# Altium project I2C_module_v1.PrjPcb
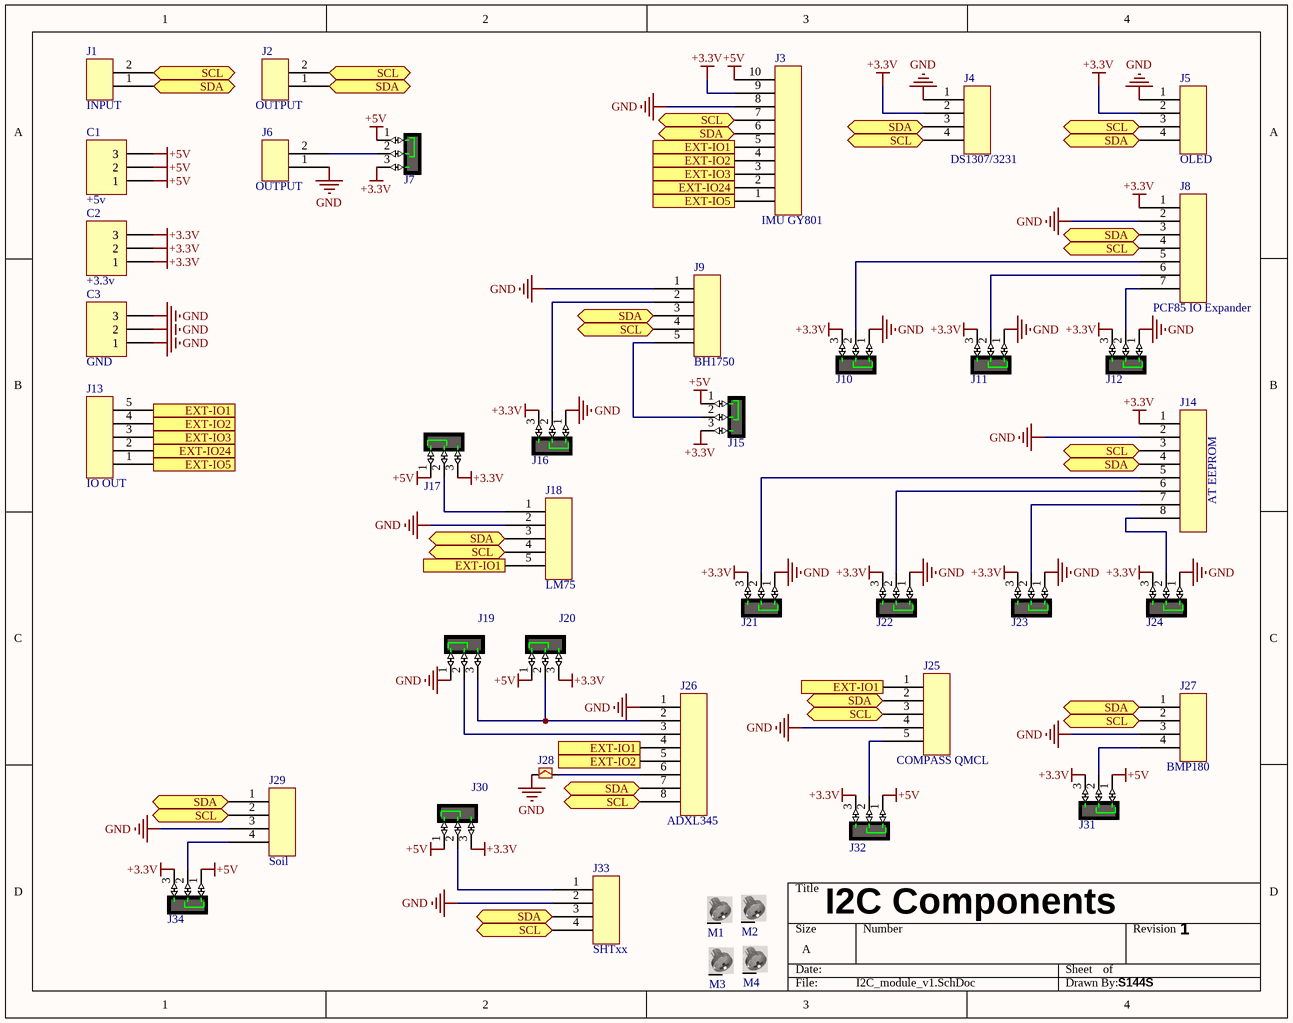
[diagram p0: I2C_module_v1.SchDoc]
1 sheet, 41 parts. Net scope: flat (ports and power ports of the same name join across sheets).
Board file: I2C_module_v1.PcbDoc

## Sheet I2C_module_v1.SchDoc
size A

### Parts
C1  +5v  [Header 3 Pin]
C2  +3.3v  [Header 3 Pin]
C3  GND  [Header 3 Pin]
J1  INPUT  [SIP2]
J2  OUTPUT  [SIP2]
J3  IMU GY801  [SIP10]
J4  DS1307/3231  [SIP4]
J5  OLED  [SIP4]
J6  OUTPUT  [SIP2]
J7  JUMPER  [SIP3]  (value not drawn)
J8  PCF85 IO Expander  [SIP7]
J9  BH1750  [SIP5]
J10  JUMPER  [SIP3]  (value not drawn)
J11  JUMPER  [SIP3]  (value not drawn)
J12  JUMPER  [SIP3]  (value not drawn)
J13  IO OUT  [SIP5]
J14  AT EEPROM  [SIP8]
J15  JUMPER  [SIP3]  (value not drawn)
J16  JUMPER  [SIP3]  (value not drawn)
J17  JUMPER  [SIP3]  (value not drawn)
J18  LM75  [SIP5]
J19  JUMPER  [SIP3]  (value not drawn)
J20  JUMPER  [SIP3]  (value not drawn)
J21  JUMPER  [SIP3]  (value not drawn)
J22  JUMPER  [SIP3]  (value not drawn)
J23  JUMPER  [SIP3]  (value not drawn)
J24  JUMPER  [SIP3]  (value not drawn)
J25  COMPASS QMCL  [SIP5]
J26  ADXL345  [SIP8]
J27  BMP180  [SIP4]
J28  JUMPER2  [JUMP2]  (value not drawn)
J29  Soil  [SIP4]
J30  JUMPER  [SIP3]  (value not drawn)
J31  JUMPER  [SIP3]  (value not drawn)
J32  JUMPER  [SIP3]  (value not drawn)
J33  SHTxx  [SIP4]
J34  JUMPER  [SIP3]  (value not drawn)
M1  Screw  [Board Screw_No Silk]  (value not drawn)
M2  Screw  [Board Screw_No Silk]  (value not drawn)
M3  Screw  [Board Screw_No Silk]  (value not drawn)
M4  Screw  [Board Screw_No Silk]  (value not drawn)

### Ports
EXT-IO1 (in), EXT-IO1 (out), EXT-IO2 (in), EXT-IO2 (out), EXT-IO3 (in), EXT-IO3 (out), EXT-IO5 (in), EXT-IO5 (out), EXT-IO24 (in), EXT-IO24 (out), SCL (bidir), SDA (bidir)

### Nets
+3.3V: C2.1 C2.2 C2.3 J3.9 J4.2 J5.2 J7.3 J8.1 J10.3 J11.3 J12.3 J14.1 J15.3 J16.3 J17.3 J20.3 J21.3 J22.3 J23.3 J24.3 J30.3 J31.3 J32.3 J34.3
+5V: C1.1 C1.2 C1.3 J3.10 J7.1 J15.1 J17.1 J20.1 J30.1 J31.1 J32.1 J34.1
GND: C3.1 C3.2 C3.3 J3.8 J4.1 J5.1 J6.1 J8.2 J9.1 J10.1 J11.1 J12.1 J14.2 J16.1 J18.2 J19.1 J21.1 J22.1 J23.1 J24.1 J25.4 J26.1 J27.3 J28.1 J29.3 J33.2
NetJ1_1: J1.1 J2.1 J3.6 J4.3 J5.4 J8.3 J9.3 J14.4 J18.3 J25.2 J26.7 J27.1 J29.1 J33.3 ; port SDA
NetJ1_2: J1.2 J2.2 J3.7 J4.4 J5.3 J8.4 J9.4 J14.3 J18.4 J25.3 J26.8 J27.2 J29.2 J33.4 ; port SCL
NetJ3_1: J3.1 J13.1 ; port EXT-IO5
NetJ3_2: J3.2 J13.2 ; port EXT-IO24
NetJ3_3: J3.3 J13.3 ; port EXT-IO3
NetJ3_4: J3.4 J13.4 J26.5 ; port EXT-IO2
NetJ3_5: J3.5 J13.5 J18.5 J25.1 J26.4 ; port EXT-IO1
NetJ6_2: J6.2 J7.2
NetJ8_5: J8.5 J10.2
NetJ8_6: J8.6 J11.2
NetJ8_7: J8.7 J12.2
NetJ9_2: J9.2 J16.2
NetJ9_5: J9.5 J15.2
NetJ14_5: J14.5 J21.2
NetJ14_6: J14.6 J22.2
NetJ14_7: J14.7 J23.2
NetJ14_8: J14.8 J24.2
NetJ17_2: J17.2 J18.1
NetJ19_2: J19.2 J26.3
NetJ19_3: J19.3 J20.2 J26.2
NetJ25_5: J25.5 J32.2
NetJ26_6: J26.6 J28.2
NetJ27_4: J27.4 J31.2
NetJ29_4: J29.4 J34.2
NetJ30_2: J30.2 J33.1

Not connected (* = marked no-connect by the designer): M1 S; M2 S; M3 S; M4 S

### Notes on the sheet
- I2C Components
- 1
- S144S

### Library data of the parts
C1-C3 = Header-3
J1 J2 J6 = 2PIN
J3 = 10PIN
J4 J5 J27 J29 J33 = 4PIN
J7 J10-J12 J15-J17 J19-J24 J30-J32 J34 = JUMPER3: JUMPER 3 PIN [ 3 OPTION ]
J8 = 7PIN
J9 J13 J18 J25 = 5PIN
J14 J26 = 8PIN
J28 = JUMPER2: Ju,per & dip Switch
M1-M4 = Board Screw: Board Screw With Spacer